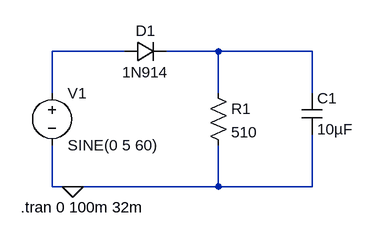
[diagram p0: schematic Diode.asc]
Diode.asc, the LTspice schematic file:
Version 4
SHEET 1 880 680
WIRE 144 48 32 48
WIRE 288 48 208 48
WIRE 432 48 288 48
WIRE 32 112 32 48
WIRE 288 112 288 48
WIRE 432 112 432 48
WIRE 32 256 32 192
WIRE 64 256 32 256
WIRE 288 256 288 192
WIRE 288 256 64 256
WIRE 432 256 432 176
WIRE 432 256 288 256
FLAG 64 256 0
SYMBOL voltage 32 96 R0
WINDOW 123 0 0 Left 0
WINDOW 39 0 0 Left 0
SYMATTR InstName V1
SYMATTR Value SINE(0 5 60)
SYMBOL diode 144 64 R270
WINDOW 0 32 32 VTop 2
WINDOW 3 0 32 VBottom 2
SYMATTR InstName D1
SYMATTR Value 1N914
SYMBOL res 272 96 R0
SYMATTR InstName R1
SYMATTR Value 510
SYMBOL cap 416 112 R0
SYMATTR InstName C1
SYMATTR Value 10µF
TEXT -16 288 Left 2 !.tran 0 100m 32m

The netlist it stands for:
* Diode.asc
V1 N001 0 SINE(0 5 60)
D1 N001 N002 1N914
R1 N002 0 510
C1 N002 0 10µF
.model D D
.lib standard.dio
.tran 0 100m 32m
.backanno
.end